# EAGLE design cerberus-h2 (EAGLE 5.10)
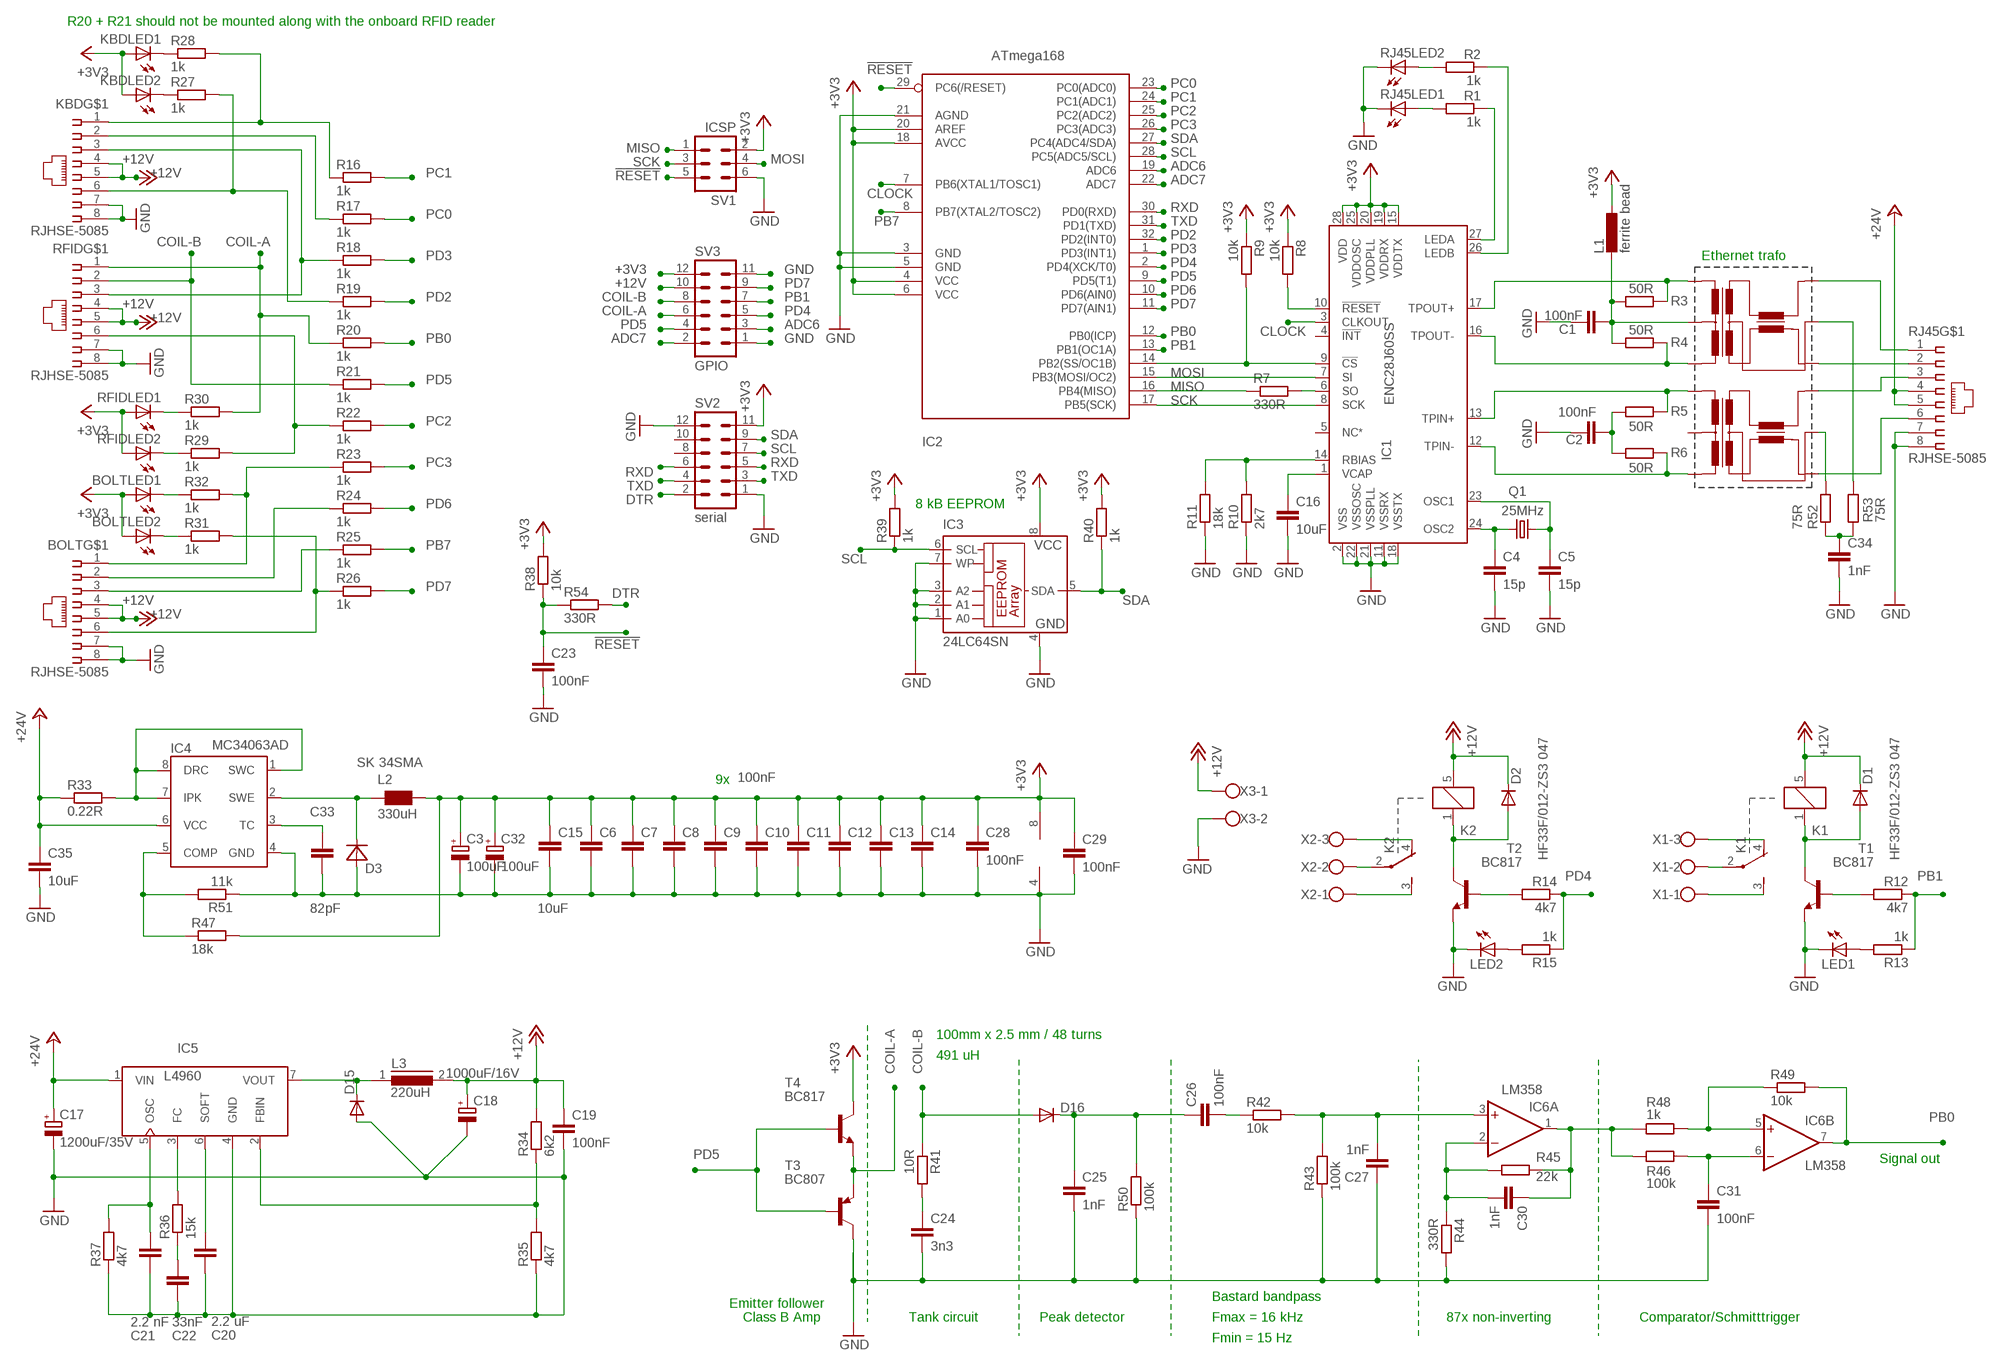
[diagram p0: schematic, sheet 1]

## Parts
BOLT  RJHSE-5085  [RJ45]
C1  100nF  C-EUC0805  [C0805]
C2  100nF  C-EUC0805  [C0805]
C3  100uF  CPOL-EUSANYO_SMD_C6  [SANYO-OSCON_SMD_C6]
C4  15p  C-EUC0805  [C0805]
C5  15p  C-EUC0805  [C0805]
C6  100nF  C-EUC0805  [C0805]
C7  100nF  C-EUC0805  [C0805]
C8  100nF  C-EUC0805  [C0805]
C9  100nF  C-EUC0805  [C0805]
C10  100nF  C-EUC0805  [C0805]
C11  100nF  C-EUC0805  [C0805]
C12  100nF  C-EUC0805  [C0805]
C13  100nF  C-EUC0805  [C0805]
C14  100nF  C-EUC0805  [C0805]
C15  10uF  C-EUC0805  [C0805]
C16  10uF  C-EUC0805  [C0805]
C17  1200uF/35V  CPOL-EUE5-13  [E5-13]
C18  1000uF/16V  CPOL-EUE5-13  [E5-13]
C19  100nF  C-EUC0805  [C0805]
C20  2.2 uF  C-EUC0805  [C0805]
C21  2.2 nF  C-EUC0805  [C0805]
C22  33nF  C-EUC0805  [C0805]
C23  100nF  C-EUC0805  [C0805]
C24  3n3  C-EUC0805  [C0805]
C25  1nF  C-EUC0805  [C0805]
C26  100nF  C-EUC0805  [C0805]
C27  1nF  C-EUC0805  [C0805]
C28  100nF  C-EUC0805  [C0805]
C29  100nF  C-EUC0805  [C0805]
C30  1nF  C-EUC0805  [C0805]
C31  100nF  C-EUC0805  [C0805]
C32  100uF  CPOL-EUSANYO_SMD_C6  [SANYO-OSCON_SMD_C6]
C33  82pF  C-EUC0805  [C0805]
C34  1nF  C-EUC0805  [C0805]
C35  10uF  C-EUC0805  [C0805]
D1  DIODE-MINIMELF  [MINIMELF]
D2  DIODE-MINIMELF  [MINIMELF]
D3  SK 34SMA  MBRA340T3  [SMA]
D15  DIODE-TO220V  [TO220ACS]
D16  DIODE-MINIMELF  [MINIMELF]
IC1  ENC28J60SS  [SSOP28]
IC2  ATmega168  MEGA8-AI  [TQFP32-08]
IC3  24LC64SN  [SO-08]
IC4  MC34063AD  [SO08]
IC5  L4960  [HEPTAWATT]
IC6  LM358  LM358D  [SO08]
K1  HF33F/012-ZS3 047  G5SB  [G5SB]
K2  HF33F/012-ZS3 047  G5SB  [G5SB]
KBD  RJHSE-5085  [RJ45]
L1  ferrite bead  L-EU0204V  [0204V@1]
L2  330uH  WE-TI_L  [WE-TI_L]
L3  220uH  A26GFC  [A26GFC]
LED1  LEDCHIP-LED0805  [CHIP-LED0805]
LED2  LEDCHIP-LED0805  [CHIP-LED0805]
Q1  25MHz  CRYSTALHC49UP  [HC49UP]
R1  1k  R-EU_R0805  [R0805]
R2  1k  R-EU_R0805  [R0805]
R3  50R  R-EU_R0805  [R0805]
R4  50R  R-EU_R0805  [R0805]
R5  50R  R-EU_R0805  [R0805]
R6  50R  R-EU_R0805  [R0805]
R7  330R  R-EU_R0805  [R0805]
R8  10k  R-EU_R0805  [R0805]
R9  10k  R-EU_R0805  [R0805]
R10  2k7  R-EU_R0805  [R0805]
R11  18k  R-EU_R0805  [R0805]
R12  4k7  R-EU_R0805  [R0805]
R13  1k  R-EU_R0805  [R0805]
R14  4k7  R-EU_R0805  [R0805]
R15  1k  R-EU_R0805  [R0805]
R16  1k  R-EU_R0805  [R0805]
R17  1k  R-EU_R0805  [R0805]
R18  1k  R-EU_R0805  [R0805]
R19  1k  R-EU_R0805  [R0805]
R20  1k  R-EU_R0805  [R0805]
R21  1k  R-EU_R0805  [R0805]
R22  1k  R-EU_R0805  [R0805]
R23  1k  R-EU_R0805  [R0805]
R24  1k  R-EU_R0805  [R0805]
R25  1k  R-EU_R0805  [R0805]
R26  1k  R-EU_R0805  [R0805]
R27  1k  R-EU_R0805  [R0805]
R28  1k  R-EU_R0805  [R0805]
R29  1k  R-EU_R0805  [R0805]
R30  1k  R-EU_R0805  [R0805]
R31  1k  R-EU_R0805  [R0805]
R32  1k  R-EU_R0805  [R0805]
R33  0.22R  R-EU_0204/2V  [0204V]
R34  6k2  R-EU_R0805  [R0805]
R35  4k7  R-EU_R0805  [R0805]
R36  15k  R-EU_R0805  [R0805]
R37  4k7  R-EU_R0805  [R0805]
R38  10k  R-EU_R0805  [R0805]
R39  1k  R-EU_R0805  [R0805]
R40  1k  R-EU_R0805  [R0805]
R41  10R  R-EU_R0805  [R0805]
R42  10k  R-EU_R0805  [R0805]
R43  100k  R-EU_R0805  [R0805]
R44  330R  R-EU_R0805  [R0805]
R45  22k  R-EU_R0805  [R0805]
R46  100k  R-EU_R0805  [R0805]
R47  18k  R-EU_R0805  [R0805]
R48  1k  R-EU_R0805  [R0805]
R49  10k  R-EU_R0805  [R0805]
R50  100k  R-EU_R0805  [R0805]
R51  11k  R-EU_R0805  [R0805]
R52  75R  R-EU_R0805  [R0805]
R53  75R  R-EU_R0805  [R0805]
R54  330R  R-EU_R0805  [R0805]
RFID  RJHSE-5085  [RJ45]
RJ45  RJHSE-5085  [RJ45]
SV1  ICSP  MA03-2  [MA03-2]
SV2  serial  MA06-2  [MA06-2]
SV3  GPIO  MA06-2  [MA06-2]
T1  BC817  BC817-16-NPN-SOT23-BEC  [SOT23-BEC]
T2  BC817  BC817-16-NPN-SOT23-BEC  [SOT23-BEC]
T3  BC807  BC807-16-PNP-SOT23-BEC  [SOT23-BEC]
T4  BC817  BC817-16-NPN-SOT23-BEC  [SOT23-BEC]
U$1  PE-68517L  [PE-68517]
X1  W237-103  [W237-103]
X2  W237-103  [W237-103]
X3  W237-102  [W237-102]

## Nets
12VPULSE: D15.C IC5.7(VOUT) L3.1
!RESET: C23.1 IC2.29(PC6(/RESET)) R38.1 R54.1 SV1.5
+3V3: BOLT.10(LED1:A) BOLT.12(LED2:A) C3.+ C6.1 C7.1 C8.1 C9.1 C10.1 C11.1 C12.1 C13.1 C14.1 C15.1 C28.1 C29.1 C32.+ IC1.15(VDDTX) IC1.19(VDDRX) IC1.20(VDDPLL) IC1.25(VDDOSC) IC1.28(VDD) IC2.4(VCC) IC2.6(VCC) IC2.18(AVCC) IC2.20(AREF) IC3.8(VCC) IC6.8(P:V+) KBD.10(LED1:A) KBD.12(LED2:A) L1.1 L2.1 R8.1 R9.1 R38.2 R39.2 R40.2 R47.2 RFID.10(LED1:A) RFID.12(LED2:A) SV1.2 SV2.11 SV3.12 T4.C
+12V: BOLT.4 BOLT.5 C18.+ C19.1 D1.C D2.C K1.5 K2.5 KBD.4 KBD.5 L3.2 R34.2 RFID.4 RFID.5 SV3.10 X3.1
+24V: C17.+ C35.1 IC4.6(VCC) IC5.1(VIN) R33.1 RJ45.4 RJ45.5
ADC6: IC2.19(ADC6) SV3.3
ADC7: IC2.22(ADC7) SV3.2
CLOCK: IC1.3(CLKOUT) IC2.7(PB6(XTAL1/TOSC1))
COIL-A: R20.1 R30.2 RFID.1 SV3.6 T3.E T4.E
COIL-B: D16.A R21.1 R41.1 RFID.2 SV3.8
DTR: R54.2 SV2.2
FC: IC5.3(FC) R36.2
GND: BOLT.7 BOLT.8 C1.1 C2.1 C3.- C4.2 C5.2 C6.2 C7.2 C8.2 C9.2 C10.2 C11.2 C12.2 C13.2 C14.2 C15.2 C16.2 C17.- C18.- C19.2 C20.2 C21.2 C22.2 C23.2 C24.2 C25.2 C27.1 C28.2 C29.2 C31.2 C32.- C33.2 C34.2 C35.2 D3.A D15.A IC1.2(VSS) IC1.11(VSSRX) IC1.18(VSSTX) IC1.21(VSSPLL) IC1.22(VSSOSC) IC2.3(GND) IC2.5(GND) IC2.21(AGND) IC3.1(A0) IC3.2(A1) IC3.3(A2) IC3.4(GND) IC3.7(WP) IC4.4(GND) IC5.4(GND) IC6.4(P:V-) KBD.7 KBD.8 LED1.C LED2.C R10.1 R11.1 R35.1 R37.1 R43.1 R44.2 R50.1 R51.1 RFID.7 RFID.8 RJ45.7 RJ45.8 RJ45.9(LED1:C) RJ45.11(LED2:C) SV1.6 SV2.1 SV2.12 SV3.1 SV3.11 T1.E T2.E T3.C X3.2
MISO: IC2.16(PB4(MISO)) R7.1 SV1.1
MOSI: IC1.7(SI) IC2.15(PB3(MOSI/OC2)) SV1.4
N$1: RJ45.1 U$1.9(RX+)
N$2: RJ45.2 U$1.10(RX-)
N$3: RJ45.3 U$1.8(TX+)
N$4: RJ45.6 U$1.7(TX-)
N$5: R2.2 RJ45.12(LED2:A)
N$6: R1.2 RJ45.10(LED1:A)
N$7: IC1.27(LEDA) R1.1
N$8: IC1.26(LEDB) R2.1
N$9: C1.2 L1.2 R3.2 R4.2 U$1.14(RCT)
N$12: IC1.10(!RESET) R8.2
N$13: C2.2 R5.2 R6.2
N$16: IC1.14(RBIAS) R10.2 R11.2
N$17: C16.1 IC1.1(VCAP)
N$18: C4.1 IC1.24(OSC2) Q1.1
N$19: IC1.6(SO) R7.2
N$20: C5.1 IC1.23(OSC1) Q1.2
N$21: K2.4(U:O) X2.3
N$23: D1.A K1.1 T1.C
N$24: K1.2(U:P) X1.2
N$25: R12.2 T1.B
N$26: K1.3(U:S) X1.1
N$27: LED1.A R13.2
N$28: D2.A K2.1 T2.C
N$29: R14.2 T2.B
N$30: K1.4(U:O) X1.3
N$31: K2.2(U:P) X2.2
N$32: K2.3(U:S) X2.1
N$33: LED2.A R15.2
N$34: KBD.3 R18.1 RFID.3
N$35: KBD.2 R17.1
N$37: IC5.2(FBIN) R34.1 R35.2
N$38: C21.1 IC5.5(OSC) R37.2
N$39: C22.1 R36.1
N$40: C20.1 IC5.6(SOFT)
N$41: KBD.6 R19.1 R27.2
N$42: KBD.1 R16.1 R28.2
N$45: R52.2 U$1.6(TXCT)
N$46: IC4.1(SWC) IC4.7(IPK) IC4.8(DRC) R33.2
N$47: R53.2 U$1.11(RXCT)
N$48: BOLT.3 R25.1
N$49: BOLT.1 R23.1 R32.2
N$51: KBD.9(LED1:C) R28.1
N$52: KBD.11(LED2:C) R27.1
N$55: BOLT.2 R24.1
N$56: R22.1 R29.2 RFID.6
N$57: R30.1 RFID.9(LED1:C)
N$58: R29.1 RFID.11(LED2:C)
N$59: BOLT.6 R26.1 R31.2
N$60: BOLT.9(LED1:C) R32.1
N$61: BOLT.11(LED2:C) R31.1
N$62: C24.1 R41.2
N$63: C25.1 C26.1 D16.C R50.2
N$64: C26.2 R42.1
N$65: C27.2 IC6.3(A:+IN) R42.2 R43.2
N$67: C30.2 IC6.2(A:-IN) R44.1 R45.1
N$68: C33.1 IC4.3(TC)
N$69: C31.1 IC6.6(B:-IN) R46.2
N$70: C30.1 IC6.1(A:OUT) R45.2 R46.1 R48.1
N$72: C34.1 R52.1 R53.1
N$76: IC4.5(COMP) R47.1 R51.2
N$81: IC6.5(B:+IN) R48.2 R49.1
PB0: IC2.12(PB0(ICP)) IC6.7(B:OUT) R20.2 R49.2
PB1: IC2.13(PB1(OC1A)) R12.1 R13.1 SV3.7
PB2: IC1.9(!CS) IC2.14(PB2(SS/OC1B)) R9.2
PB7: IC2.8(PB7(XTAL2/TOSC2)) R25.2
PC0: IC2.23(PC0(ADC0)) R17.2
PC1: IC2.24(PC1(ADC1)) R16.2
PC2: IC2.25(PC2(ADC2)) R22.2
PC3: IC2.26(PC3(ADC3)) R23.2
PD2: IC2.32(PD2(INT0)) R19.2
PD3: IC2.1(PD3(INT1)) R18.2
PD4: IC2.2(PD4(XCK/T0)) R14.1 R15.1 SV3.5
PD5: IC2.9(PD5(T1)) R21.2 SV3.4 T3.B T4.B
PD6: IC2.10(PD6(AIN0)) R24.2
PD7: IC2.11(PD7(AIN1)) R26.2 SV3.9
RXD: IC2.30(PD0(RXD)) SV2.5 SV2.6
SCK: IC1.8(SCK) IC2.17(PB5(SCK)) SV1.3
SCL: IC2.28(PC5(ADC5/SCL)) IC3.6(SCL) R39.1 SV2.7
SDA: IC2.27(PC4(ADC4/SDA)) IC3.5(SDA) R40.1 SV2.9
SWE: D3.C IC4.2(SWE) L2.2
TPIN+: IC1.13(TPIN+) R5.1 U$1.1(TD+)
TPIN-: IC1.12(TPIN-) R6.1 U$1.2(TD-)
TPOUT+: IC1.17(TPOUT+) R3.1 U$1.16(RD+)
TPOUT-: IC1.16(TPOUT-) R4.1 U$1.15(RD-)
TXD: IC2.31(PD1(TXD)) SV2.3 SV2.4
Unconnected: IC1.4(!INT) IC1.5(NC*) SV2.8 SV2.10 U$1.3(TCT)

## Notes on the sheet
- R20 + R21 should not be mounted along with the onboard RFID reader
- Ethernet trafo
- 8 kB EEPROM
- 9x
- 100mm x 2.5 mm / 48 turns
- 491 uH
- Signal out
- Bastard bandpass
- Emitter follower
- Class B Amp | Tank circuit | Peak detector | Fmax = 16 kHz | 87x non-inverting | Comparator/Schmitttrigger
- Fmin = 15 Hz

## Library data of the parts
BOLT KBD RFID RJ45 = amp-rj45-tap-up-with-leds:RJHSE-5085: Amphenol RJHSE-5085 - RJ45 with 2 leds and tap-up.
C1 C2 C4-C16 C19-C31 C34 C35 = rcl:C-EU: CAPACITOR, European symbol
C3 C17 C18 C32 = rcl:CPOL-EU: POLARIZED CAPACITOR, European symbol
C33 = resistor:C-EU: CAPACITOR, European symbol
D1 D2 D15 D16 = diode:DIODE-: DIODE
D3 = diode:MBRA340T3: Surface Mount Schottky Power Rectifier Source: http://www.onsemi.com/pub_link/Collateral/MBRA340T3-D.PDF
IC1 = microchip-6:ENC28J60: Stand-Alone Ethernet Controller with SPI Interface Source: http://ww1.microchip.com/downloads/en/DeviceDoc/39662c.pdf
IC2 = atmel:MEGA8: MICROCONTROLLER 8 Kbytes FLASH, 1 kbytes SRAM, 512 bytes EEPROM, USART, 6-channel 10 bit ADC, 2-channel 8 bit ADC Pin compatible with Atmega48, ATMega88, ATMega168 Source: avr.lbr
IC3 = microchip:24*: Serial EEPROM I2C
IC4 = v-reg-3:MC34063A: 1.5A Step-Up/Down/Inverting Switching Regulator NPN Darlington Switch, Vin 3V to 40V, Current Limiter Input, adjustable Frequency up to 100kHz
IC5 = l4960:L4960: 2.5A POWER SWITCHING REGULATOR
IC6 = linear:LM358: OP AMP also LM158; LM258; LM2904 Source: http://cache.national.com/ds/LM/LM158.pdf
K1 K2 = relay:G5SB: Compact Single-pole Relay for Switching 5 A Source: http://www.omron.com/ecb/products/pry/121/g5sb.html
L1 = rcl:L-EU: INDUCTOR, European symbol
L2 = wuerth-elektronik:WE-TI: Radial Leaded Wire Wound Inductor WE-TI A low-cost storage/filtering possibility in comparison to SMD versions - Radial through-hole inductor - High saturation core material -- Signal filtering -- NF-switches
L3 = inductors:A26GFC: INDUCTOR
LED1 LED2 = led:LED: LED OSRAM: - CHIPLED LG R971, LG N971, LY N971, LG Q971, LY Q971, LO R971, LY R971 LH N974, LH R974 LS Q976, LO Q976, LY Q976 LO Q996 - Hyper CHIPLED LW Q18S LB Q993, LB Q99A, LB R99A - SideLED LS A670, LO A670, LY A670, LG A670, LP A670 LB A673, LV A673, LT A673, LW A673 LH A674 LY A675 LS A676, LA A676, LO A676, LY A676, LW A676 LS A679, LY A679, LG A679 - Hyper Micro SIDELED® LS Y876, LA Y876, LO Y876, LY Y876 LT Y87S - SmartLED LW L88C, LW L88S LB L89C, LB L89S, LG L890 LS L89K, LO L89K, LY L89K LS L896, LA L896, LO L896, LY L896 - TOPLED LS T670, LO T670, LY T670, LG T670, LP T670 LSG T670, LSP T670, LSY T670, LOP T670, LYG T670 LG T671, LOG T671, LSG T671 LB T673, LV T673, LT T673, LW T673 LH T674 LS T676, LA T676, LO T676, LY T676, LB T676, LH T676, LSB T676, LW T676 LB T67C, LV T67C, LT T67C, LS T67K, LO T67K, LY T67K, LW E67C LS E67B, LA E67B, LO E67B, LY E67B, LB E67C, LV E67C, LT E67C LW T67C LS T679, LY T679, LG T679 LS T770, LO T770, LY T770, LG T770, LP T770 LB T773, LV T773, LT T773, LW T773 LH T774 LS E675, LA E675, LY E675, LS T675 LS T776, LA T776, LO T776, LY T776, LB T776 LHGB T686 LT T68C, LB T68C - Hyper Mini TOPLED® LB M676 - Mini TOPLED Santana® LG M470 LS M47K, LO M47K, LY M47K Source: http://www.osram.convergy.de LUXEON: - LUMILED® LXK2-PW12-R00, LXK2-PW12-S00, LXK2-PW14-U00, LXK2-PW14-V00 LXK2-PM12-R00, LXK2-PM12-S00, LXK2-PM14-U00 LXK2-PE12-Q00, LXK2-PE12-R00, LXK2-PE12-S00, LXK2-PE14-T00, LXK2-PE14-U00 LXK2-PB12-K00, LXK2-PB12-L00, LXK2-PB12-M00, LXK2-PB14-N00, LXK2-PB14-P00, LXK2-PB14-Q00 LXK2-PR12-L00, LXK2-PR12-M00, LXK2-PR14-Q00, LXK2-PR14-R00 LXK2-PD12-Q00, LXK2-PD12-R00, LXK2-PD12-S00 LXK2-PH12-R00, LXK2-PH12-S00 LXK2-PL12-P00, LXK2-PL12-Q00, LXK2-PL12-R00 Source: www.luxeon.com KINGBRIGHT: KA-3528ASYC Source: www.kingbright.com
Q1 = crystal:CRYSTAL: CRYSTAL
R1-R54 = rcl:R-EU_: RESISTOR, European symbol
SV1 = con-lstb:MA03-2: PIN HEADER
SV2 SV3 = con-lstb:MA06-2: PIN HEADER
T1 T2 T4 = transistor:*-NPN-: NPN Transistror BF959 corrected 2008.03.06
T3 = transistor:*-PNP-: PNP Transistror
U$1 = pulse-pe-68517-ethernet-trafo:PE-68517L
X1 X2 = con-wago-500:W237-103: WAGO SCREW CLAMP
X3 = con-wago-500:W237-102: WAGO SCREW CLAMP

## Board
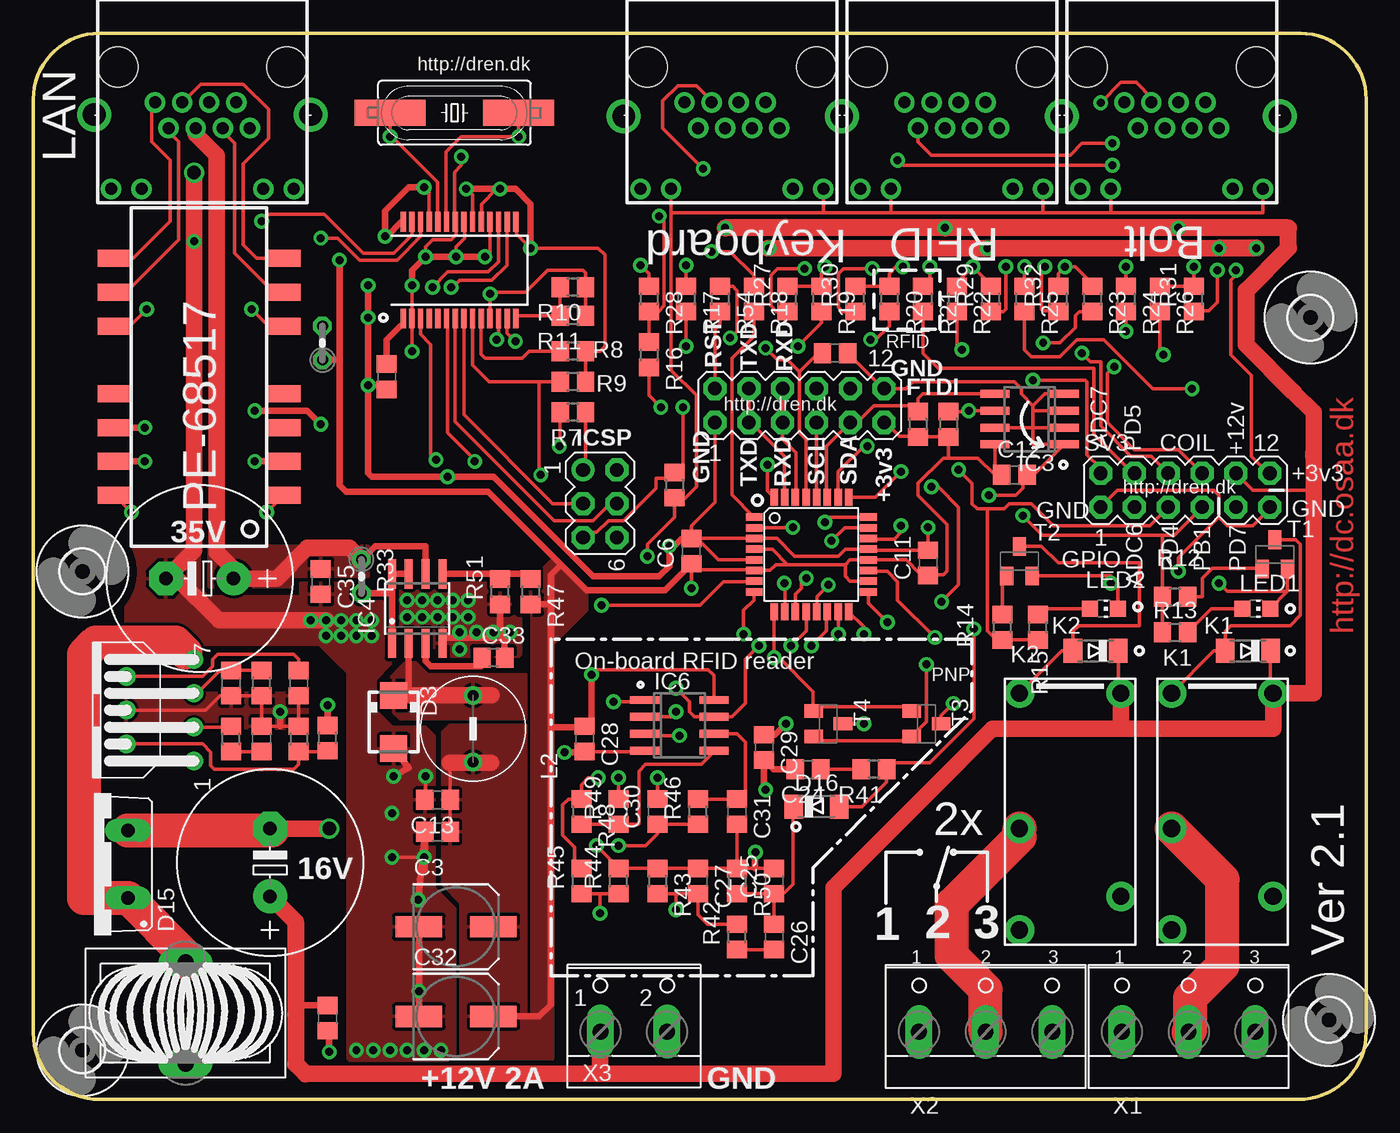
[diagram p1: board, top side]
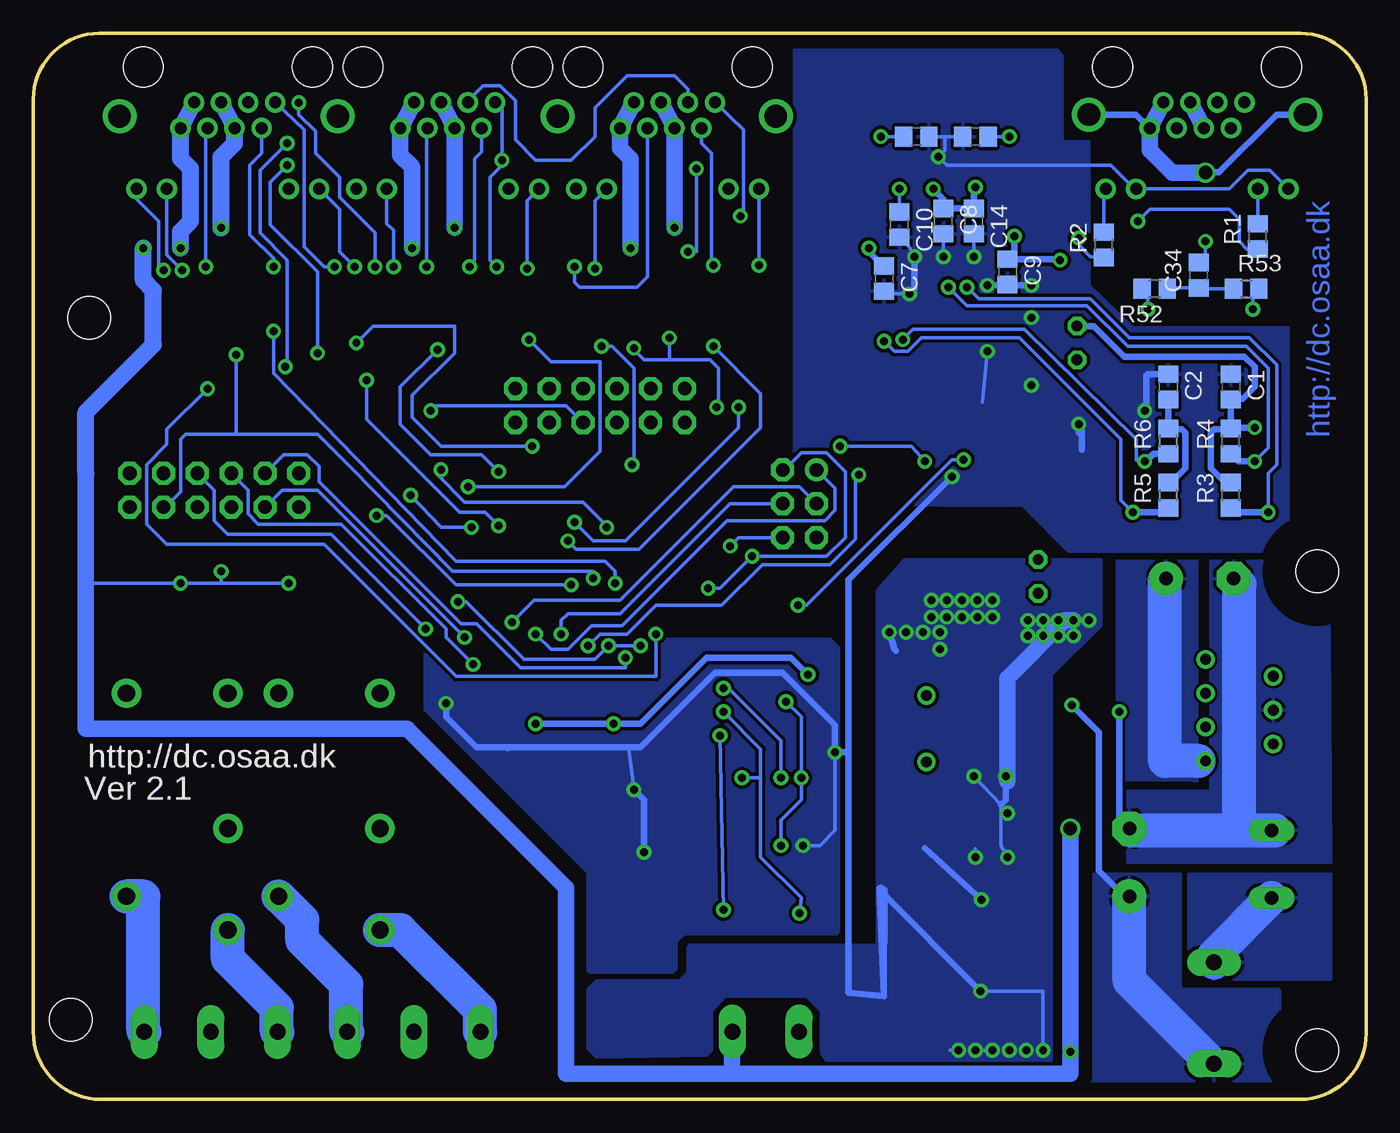
[diagram p2: board, bottom side, seen from below]

Size 100.08 x 80.01 mm. Coordinates in mm from the lower left corner, seen from the top.
Outline: 95.05,80 4.95,80
Outline: 5.08,80.01 4.95,80.01 arc90 0,75.06 0,4.95 arc90 4.95,0 95,0 arc90 100.08,5.08 100.08,75.06 arc90 95.12,80.01 95,80.01
Copper layers (1*16): Top 0.035mm / dielectric 1.5mm / Bottom 0.035mm
Design rules "8mils *": minimum track width 8mil, minimum drill 0.6mm, track to track 8mil, track to pad 8mil, pad to pad 8mil, via to via 8mil, smd to smd 8mil, copper to edge 40mil, drill to drill 10mil, minimum pad ring 8mil, minimum via ring 10mil, stop-mask expansion 0mil, vias tented up to drill 0mil, thermal gap 10mil

### Footprints (pad centres in the part's own frame; a part is rotated, then mirrored left to right if it is on the bottom)
RJ45 = drill 0.9 pad 1.27 round: 1 9.906,2.64; 2 8.89,4.58; 3 7.874,2.64; 4 6.858,4.58; 5 5.842,2.64; 6 4.826,4.58; 7 3.81,2.64; 8 2.794,4.58; 9 13.208,9.144; 10 10.922,9.144; 11 1.778,9.144; 12 -0.508,9.144 | hole 3: 0,0; 12.7,0
C0805 = smd 1.3 x 1.5: 1 -0.95,0; 2 0.95,0
SANYO-OSCON_SMD_C6 = smd 3.5 x 1.6: + 2.8,0; - -2.8,0
E5-13 = drill 1.016 pad 2.54 round: + -2.54,0 | drill 1.016 pad 2.54 octagon: - 2.54,0
C0805' = smd 1.3 x 1.5: 1 -0.85,0; 2 0.85,0
MINIMELF = smd 1.4 x 1.8: A 1.7,0; C -1.7,0
SMA = smd 2 x 2: A 2,0; C -2,0
TO220ACS = drill 1.016 long: A 2.54,-2.54; C -2.54,-2.54
SSOP28 = smd 0.4 x 1.5: 1 -4.225,-3.625; 2 -3.575,-3.625; 3 -2.925,-3.625; 4 -2.275,-3.625; 5 -1.625,-3.625; 6 -0.975,-3.625; 7 -0.325,-3.625; 8 0.325,-3.625; 9 0.975,-3.625; 10 1.625,-3.625; 11 2.275,-3.625; 12 2.925,-3.625; 13 3.575,-3.625; 14 4.225,-3.625; 15 4.225,3.625; 16 3.575,3.625; 17 2.925,3.625; 18 2.275,3.625; 19 1.625,3.625; 20 0.975,3.625; 21 0.325,3.625; 22 -0.325,3.625; 23 -0.975,3.625; 24 -1.625,3.625; 25 -2.275,3.625; 26 -2.925,3.625; 27 -3.575,3.625; 28 -4.225,3.625
TQFP32-08 = smd 1.27 x 0.559: 1 -4.293,2.8; 2 -4.293,2; 3 -4.293,1.2; 4 -4.293,0.4; 5 -4.293,-0.4; 6 -4.293,-1.2; 7 -4.293,-2; 8 -4.293,-2.8; 17 4.293,-2.8; 18 4.293,-2; 19 4.293,-1.2; 20 4.293,-0.4; 21 4.293,0.4; 22 4.293,1.2; 23 4.293,2; 24 4.293,2.8 | smd 0.559 x 1.27: 9 -2.8,-4.293; 10 -2,-4.293; 11 -1.2,-4.293; 12 -0.4,-4.293; 13 0.4,-4.293; 14 1.2,-4.293; 15 2,-4.293; 16 2.8,-4.293; 25 2.8,4.293; 26 2,4.293; 27 1.2,4.293; 28 0.4,4.293; 29 -0.4,4.293; 30 -1.2,4.293; 31 -2,4.293; 32 -2.8,4.293
SO-08 = smd 0.6 x 2.2: 1 -1.905,-2.6; 2 -0.635,-2.6; 3 0.635,-2.6; 4 1.905,-2.6; 5 1.905,2.6; 6 0.635,2.6; 7 -0.635,2.6; 8 -1.905,2.6
SO08 = smd 0.6 x 2.2: 1 -1.905,-2.6; 2 -0.635,-2.6; 3 0.635,-2.6; 4 1.905,-2.6; 5 1.905,2.6; 6 0.635,2.6; 7 -0.635,2.6; 8 -1.905,2.6
HEPTAWATT = drill 0.813 round: 1 3.81,5.08; 2 2.54,0; 3 1.27,5.08; 4 0,0; 5 -1.27,5.08; 6 -2.54,0; 7 -3.81,5.08
G5SB = drill 1.3 pad 1.93 round: 1 7.62,3.81; 5 7.62,-3.81 | drill 1.3 pad 2.184 round: 2 -2.54,3.81; 3 -10.16,3.81; 4 -7.62,-3.81
0204V@1 = drill 0.813 octagon: 1 -1.27,0; 2 1.27,0
WE-TI_L = drill 0.813 round: 1 -2.5,0; 2 2.5,0
A26GFC = drill 1.194 long: 1 0,3.81; 2 0,-3.81
CHIP-LED0805 = smd 1.2 x 1.2: A 0,-1.05; C 0,1.05
HC49UP = smd 5.334 x 1.93: 1 -4.826,0; 2 4.826,0
R0805 = smd 1.3 x 1.5: 1 -0.95,0; 2 0.95,0
0204V = drill 0.813 octagon: 1 -1.27,0; 2 1.27,0
MA03-2 = drill 1.016 round: 1 -2.54,-1.27 | drill 1.016 octagon: 2 -2.54,1.27; 3 0,-1.27; 4 0,1.27; 5 2.54,-1.27; 6 2.54,1.27
MA06-2 = drill 1.016 octagon: 1 -6.35,-1.27; 2 -6.35,1.27; 3 -3.81,-1.27; 4 -3.81,1.27; 5 -1.27,-1.27; 6 -1.27,1.27; 7 1.27,-1.27; 8 1.27,1.27; 9 3.81,-1.27; 10 3.81,1.27; 11 6.35,-1.27; 12 6.35,1.27
SOT23-BEC = smd 1 x 1.4: B -0.95,-1.1; C 0,1.1; E 0.95,-1.1
PE-68517 = smd 2.54 x 1.27: 1 -7.62,7.62; 2 -7.62,5.08; 3 -7.62,2.54; 4 -7.62,0; 6 -7.62,-5.08; 7 -7.62,-7.62; 8 -7.62,-10.16; 9 5.08,-10.16; 10 5.08,-7.62; 11 5.08,-5.08; 13 5.08,0; 14 5.08,2.54; 15 5.08,5.08; 16 5.08,7.62
3,2 = hole 3.2: 0,0
W237-103 = drill 1.194 long: 1 -5,-1.29; 2 0,-1.29; 3 5,-1.29
W237-102 = drill 1.194 long: 1 -2.5,-1.27; 2 2.5,-1.27

### Placement (x,y rotation side)
BOLT  91.82,77.47 180 top
C1  10.16,53.47 270 bottom
C2  14.86,53.47 270 bottom
C3  31.75,12.95 0 top
C4  29.34,72.26 180 bottom
C5  33.78,72.26 0 bottom
C6  49.4,41.15 90 top
C7  36.2,61.59 270 bottom
C8  31.75,65.91 270 bottom
C9  26.92,62.1 270 bottom
C10  35.05,65.66 270 bottom
C11  67.18,40.26 90 top
C12  73.66,46.86 0 top
C13  30.35,22.48 180 top
C14  29.46,65.91 270 bottom
C15  30.35,20.07 180 top
C16  26.54,54.23 270 top
C17  12.5,39.09 180 top
C18  17.78,17.78 90 top
C19  22.1,6.1 270 top
C20  19.94,31.24 270 top
C21  14.86,31.24 270 top
C22  17.14,27.05 90 top
C23  60.2,56.01 0 top
C24  58.17,24.77 180 top
C25  55.63,16.38 90 top
C26  55.63,12.19 270 top
C27  49.91,16.38 270 top
C28  41.4,27.05 270 top
C29  54.86,26.42 270 top
C30  46.86,21.59 90 top
C31  52.83,21.59 270 top
C32  31.75,6.22 0 top
C33  82pF  [C0805']  34.54,33.15 0 top
C34  12.57,61.85 90 bottom
C35  21.59,38.86 270 top
D1  91.19,33.66 180 top
D2  79.76,33.66 180 top
D3  27.05,28.32 270 top
D15  4.57,17.65 90 top
D16  58.8,21.97 0 top
IC1  32,62.23 0 top
IC2  58.42,40.89 0 top
IC3  74.8,51.05 90 top
IC4  28.83,36.83 0 top
IC5  6.99,29.21 270 top
IC6  48.51,28.07 270 top
K1  89.28,22.86 90 top
K2  77.85,22.86 90 top
KBD  58.8,77.47 180 top
L1  21.72,56.77 90 top
L2  33.02,27.81 90 top
L3  11.43,6.48 0 top
LED1  91.82,36.83 270 top
LED2  80.39,36.83 270 top
Q1  31.62,74.04 0 top
R1  8.13,64.77 90 bottom
R2  19.68,64.14 90 bottom
R3  10.16,45.34 90 bottom
R4  10.16,49.4 90 bottom
R5  14.86,45.34 90 bottom
R6  14.86,49.4 90 bottom
R7  40.51,51.56 180 top
R8  40.51,56.13 180 top
R9  40.51,53.85 180 top
R10  40.51,60.96 180 top
R11  40.51,58.8 180 top
R12  85.72,37.72 0 top
R13  85.72,35.05 0 top
R14  72.77,35.43 90 top
R15  75.44,35.43 90 top
R16  46.23,55.88 270 top
R17  49.02,60.07 270 top
R18  54.1,60.07 270 top
R19  59.18,60.07 270 top
R20  64.26,60.07 270 top
R21  66.8,60.07 270 top
R22  69.34,60.07 270 top
R23  79.5,60.07 270 top
R24  82.04,60.07 270 top
R25  74.42,60.07 270 top
R26  84.58,60.07 270 top
R27  56.64,60.07 90 top
R28  46.23,60.07 270 top
R29  71.88,60.07 90 top
R30  61.72,60.07 90 top
R31  87.12,60.07 90 top
R32  76.96,60.07 90 top
R33  24.64,39.24 270 top
R34  22.1,27.11 90 top
R35  19.94,27.05 270 top
R36  14.86,27.05 90 top
R37  17.14,31.24 90 top
R38  48.13,46.1 270 top
R39  68.71,50.67 270 top
R40  66.42,50.67 270 top
R41  63.12,24.77 180 top
R42  52.83,12.19 90 top
R43  46.86,16.38 270 top
R44  43.94,16.38 90 top
R45  41.15,16.38 90 top
R46  49.91,21.59 90 top
R47  37.34,38.1 270 top
R48  41.15,21.59 270 top
R49  43.94,21.59 90 top
R50  52.83,16.38 270 top
R51  35.05,38.1 90 top
R52  15.88,60.83 180 bottom
R53  9.02,60.83 0 bottom
R54  51.56,60.07 270 top
RFID  75.31,77.47 180 top
RJ45  19.05,77.47 180 top
SV1  42.55,44.7 270 top
SV2  57.53,52.07 0 top
SV3  86.49,45.72 0 top
T1  93.22,40.89 0 top
T2  74.04,40.39 0 top
T3  67.06,28.19 270 top
T4  59.69,28.19 270 top
U$1  11.18,52.96 180 top
U$3  [3,2]  3.68,3.68 0 top
U$4  [3,2]  95.89,58.67 0 top
U$5  [3,2]  97.28,5.97 0 top
U$6  [3,2]  3.68,39.62 0 top
X1  86.74,6.35 0 top
X2  71.5,6.35 0 top
X3  45.09,6.35 0 top

### Tracks (layer width: path | path; a pad name or v marks a point on that pad's centre or on a via)
12VPULSE
  Top 1.27: 11.43,33.53 IC5.7
  Top 2.54: 3.81,15.24 3.81,15.11 | 3.81,15.24 3.81,33.4 4.7,34.29 10.67,34.29 11.43,33.53 | 3.81,15.24 3.94,15.11 D15.C 11.43,10.79 L3.1
  Bottom 2.54: L3.1 11.43,10.79 D15.C
  pour Bottom: 13.34,16.89 13.34,9.02 2.67,9.02 2.67,16.89
!RESET  (via drill 0.6)
  Top 0.254: IC2.29 58.02,49.55 57.53,50.04 57.53,54.61 | v54.99,56.39 55.88,55.5 56.64,55.5 57.53,54.61 | v48.77,51.94 48.77,47.69 R38.1 48.13,46.86 47.88,46.61 46.74,46.61 46.74,45.85 44.32,43.43 43.18,43.43 42.29,42.55 41.66,42.55 SV1.5 | C23.1 58.93,56.01 57.53,54.61 | R54.1 52.52,61.02 52.83,60.71 52.83,57.66 v52.32,57.15
  Bottom 0.254: v48.77,51.94 48.64,52.07 48.64,54.86 49.28,55.5 52.32,55.5 | v54.99,56.39 54.99,56.26 54.23,55.5 52.32,55.5 | 52.32,55.5 v52.32,57.15
+3V3  (via drill 0.6)
  Top 0.254: 49.91,39.75 49.46,40.2 C6.1 v49.4,38.35 | 49.91,39.75 49.66,39.75 | 49.91,39.75 54.07,39.75 IC2.6 55.31,39.69 55.75,40.13 56.64,40.13 | IC2.4 54.15,41.27 55.5,41.27 56.64,40.13 | 60.96,40.13 61.32,40.49 IC2.20 65.55,40.49 66.55,39.5 66.55,39.02 66.67,38.89 67.4,38.89 C11.1 67.24,39.37 68.33,39.37 68.58,39.62 68.58,43.18 66.42,45.34 66.42,46.23 68.33,48.13 68.71,48.13 | 62.62,38.99 IC2.18 61.31,38.89 60.96,39.24 60.96,40.13 | 56.64,40.13 60.96,40.13 | 72.2,46.86 IC3.8 | 72.2,46.86 C12.1 | v46.1,40.77 46.1,41.66 48.13,43.69 R38.2 48.2,45.09 48.9,45.09 49.78,45.97 49.78,52.83 47.88,54.74 47.88,66.55 | 44.32,38.23 44.32,38.1 | 68.71,48.13 70.93,48.13 72.2,46.86 | SV3.12 92.71,46.99 91.44,48.26 91.44,54.36 89.92,55.88 89.92,61.47 90.3,61.85 v90.3,62.23 | IC6.8 51.11,31.82 50.67,32.26 42.29,32.26 v41.91,31.88 | v62.36,28.19 T4.C | C28.1 41.91,28.51 | BOLT.12 92.33,66.55 80.9,66.55 | 47.88,66.55 59.44,66.55 | 59.44,66.55 64.39,66.55 | 64.39,66.55 75.82,66.55 | 75.82,66.55 80.9,66.55 | 47.88,66.55 KBD.10 | KBD.12 59.31,66.67 59.44,66.55 | 64.39,66.55 RFID.10 | 75.82,66.55 RFID.12 | 80.9,66.55 BOLT.10 | SV2.11 64.01,50.8 65.02,49.78 66.36,49.78 R40.2 R39.2 68.71,48.13 | 36.32,65.95 IC1.15 36.3,65.79 36.3,64.92 v37.34,63.88 42.42,63.88 42.93,63.37 42.93,56.52 42.55,56.13 R8.1 R9.1 | v35.05,68.33 34.8,68.33 33.66,67.18 33.66,65.88 IC1.19 | IC1.20 32.98,67.9 v32.51,68.33 | IC1.25 29.72,65.87 29.72,68.07 v29.34,68.45 | C15.1 C13.1 31.3,23.94 31.24,25.27 | 27.56,65.79 27.71,65.79 IC1.28
  Top 0.5: 49.72,40.39 C6.1 47.43,38.23 44.32,38.23 41.53,38.23 39.62,40.13 | 39.62,40.13 34.16,45.59 23.5,45.59 22.99,46.1 22.99,55.37 | 38.86,27.94 38.86,7.11 37.97,6.22 C32.+ | 38.86,27.94 41.34,27.94 C28.1 | 38.86,27.94 38.86,37.08 | 38.86,37.08 38.86,39.37 39.62,40.13 | 34.55,5.85 34.42,5.71 34.42,6.09 | C3.+ 34.67,13.07 | 41.91,28.51 v41.91,31.88 | C29.1 55.69,27.37 v56.52,28.19 | v32.51,68.33 v35.05,68.33 36.2,68.33 37.34,67.18 v37.34,63.88 | 22.99,55.37 v22.99,62.99 | R47.2 38.8,37.15 38.86,37.08 | v29.34,68.45 28.19,68.45 26.42,66.67 v26.42,64.77 26.67,64.9 27.56,65.79 | L1.1 22.86,55.5 22.99,55.37
  Top 1.25: 31.24,25.27 34.38,25.27 L2.1
  Bottom 0.254: SV1.2 43.69,47.24 42.42,48.51 40.51,48.51 39.12,47.12 39.12,42.16 40.51,40.77 v46.1,40.77 48.51,38.35 v49.4,38.35 | BOLT.12 92.33,67.56 90.68,65.91 90.68,62.61 v90.3,62.23 | v35.05,68.33 C10.1 | v29.34,68.45 29.46,68.2
  Bottom 0.5: v62.36,28.19 v56.52,28.19 54.48,28.19 49.53,33.15 43.18,33.15 v41.91,31.88 | C7.1 37.34,63.63 v37.34,63.88 | 29.46,68.2 C14.1 C8.1 31.75,67.56 v32.51,68.33 | v22.99,62.99 23.05,63.05 C9.1 26.42,63.56 v26.42,64.77
  pour Top (isolate 0.254): 36.96,28.07 36.96,3.05 32.26,3.05 32.13,3.17 32.13,14.73 30.73,16.13 30.73,27.56 31.24,28.07
  pour Top: 37.08,3.05 38.99,3.05 38.99,34.16 41.53,36.7 41.53,38.23 39.12,40.64 36.83,38.35 36.83,37.47 37.08,37.21 37.21,37.21 37.47,36.96 37.47,6.22 36.96,6.22
+12V  (via drill 0.6)
  Top 0.254: D2.C 81.46,30.68 K2.5 82.3,29.84 | K1.5 92.89,30.68 D1.C | 96.14,48.26 96.27,46.99 | 96.14,48.51 95.89,48.26 | SV3.10 91.57,45.72 95.63,45.72 96.14,45.21
  Top 0.5: C19.1 19.75,7.05 19.68,6.35 | v22.1,29.59 R34.2
  Top 1.25: 81.66,27.81 72.01,27.81 60.07,15.88 60.07,1.91 42.55,1.91 | 81.66,27.81 K2.5 | 81.66,27.81 93.09,27.81 K1.5 96.14,30.48 96.14,45.21 96.14,48.26 | 18.03,15.88 18.03,15.49 C18.+ | 20.45,1.91 42.55,1.91 | 42.55,1.91 42.55,5.04 X3.1 | 94.61,53.09 96.14,51.56 96.14,48.51
  Top 1.27: C18.+ 19.68,13.34 19.68,6.35 19.68,2.67 20.45,1.91 | 96.14,48.26 96.14,48.51 | 94.61,53.09 91.06,56.64 91.06,60.71 94.23,63.88 94.23,65.41 v85.98,65.41 v68.45,65.41 v51.94,65.41
  Bottom 0.5: C18.+ 18.16,15.24 20.07,17.14 20.07,27.56 v22.1,29.59
  Bottom 1.25: L3.2 11.94,3.05 | KBD.5 KBD.4 v51.94,65.41 | RFID.5 RFID.4 v68.45,65.41 | BOLT.4 BOLT.5
  Bottom 1.27: v85.98,65.41 85.98,70.74 84.96,71.75 BOLT.4
  Bottom 2.54: 11.94,3.05 17.78,8.89 C18.+
  pour Bottom: 20.57,1.4 20.45,1.52 20.45,16.89 13.97,16.89 13.97,8.38 13.84,8.26 6.6,8.26 6.48,8.13 6.48,1.4
+24V
  Top 0.5: IC4.6 29.46,41.53 25.65,41.53 R33.1
  Top 1.25: RJ45.4 12.19,72.42 13.77,70.84 13.77,41.06 14.9,39.93 14.9,39.23 C17.+ 18.26,39.09 20.57,41.4 23.75,41.4 R33.1 24.51,40.39
  Bottom 1.25: RJ45.4 RJ45.5 | C17.+ 15.14,38.99
  Bottom 1.27: IC5.1 12.57,25.4
  Bottom 2.54: 12.57,25.4 15.11,25.4 15.11,39.01 C17.+
  pour Top: 13.21,41.53 13.21,38.48 19.43,38.48 19.43,39.24 25.15,39.24 25.15,41.53
  pour Bottom: 13.46,24 18.67,24 18.67,29.72 18.67,40.39 12.7,40.39 12.7,23.88
ADC6  (via drill 0.6)
  Top 0.254: 62.77,39.75 IC2.19 62.78,39.62 64.14,39.62 64.9,38.86 64.9,37.47 v67.69,34.67
  Bottom 0.254: SV3.3 81.41,45.72 78.74,45.72 v67.69,34.67
ADC7  (via drill 0.6)
  Top 0.254: 62.78,42.16 IC2.22 62.77,42.04 64.64,42.04 65.15,42.55 v65.15,43.05 | SV3.2 80.14,47.37 79.12,48.39 79.12,53.85 78.99,53.98 v75.06,53.98
  Bottom 0.254: v65.15,43.05 66.17,44.07 68.07,44.07 75.06,51.05 v75.06,53.98
CLOCK  (via drill 0.6)
  Top 0.254: IC2.7 54.09,38.86 51.82,38.86 50.04,37.08 v42.67,37.08 | IC1.3 29.08,57.41 29.84,56.64 29.84,48.39 v30.23,48.01
  Bottom 0.254: v42.67,37.08 42.04,37.08 31.11,48.01 v30.23,48.01
COIL-A  (via drill 0.6)
  Top 0.254: T4.E 58.61,27.24 59.31,26.92 65.25,26.92 T3.E 65.98,27.24 67.06,28.32 v67.06,32.64 | SV3.6 83.95,48.26 82.42,48.26 80.14,50.55 80.14,55.37 79.38,55.37 v78.74,56.01 | v81.03,70.1 65.28,70.1 v64.9,70.48 | R30.2 R20.1 64.26,61.98 64.77,62.48 v65.28,62.48
  Bottom 0.254: RFID.1 64.9,74.93 v64.9,70.48 64.9,70.1 65.79,69.22 65.79,62.99 v65.28,62.48 | SV3.6 83.95,45.72 83.95,43.94 83.19,43.18 76.96,43.18 69.09,35.31 69.09,34.67 v67.06,32.64 | v78.74,56.01 78.74,62.1 82.3,65.66 82.3,68.83 v81.03,70.1
COIL-B  (via drill 0.6)
  Top 0.254: RFID.2 66.42,71.88 67.44,70.87 77.85,70.87 78.74,71.75 v81.03,71.75 | v70.61,35.31 70.61,28.57 67.31,25.27 64.58,25.27 R41.1 64.07,23.81 62.23,21.97 D16.A | SV3.8 85.98,48.77 82.68,48.77 80.64,50.8 80.64,54.48 v81.15,54.99 | v67.31,62.48 67.31,61.53 R21.1
  Bottom 0.254: v70.61,35.31 77.72,42.42 85.47,42.42 86.49,43.43 86.49,45.72 SV3.8 | v81.03,71.75 83.06,69.72 83.06,65.02 81.03,62.99 81.03,55.12 v81.15,54.99 | v67.31,62.48 66.93,62.99 66.93,70.61 66.42,71.12 RFID.2
DTR
  Top 0.254: SV2.2 51.18,57.78 51.56,58.17 R54.2
FC
  Top 0.254: IC5.3 14.29,27.94 R36.2
GND  (via drill 0.6, 1, 1.7)
  Top 0.254: 92.77,36.93 LED1.C 94.17,38.13 | 81.44,38.73 LED2.C | v80.9,38.73 81.44,38.73 | SV2.1 51.18,44.83 49.4,43.05 C6.2 | C6.2 IC2.3 | IC2.3 52.89,42.09 | IC2.5 54.11,40.51 51.44,40.51 50.16,41.78 49.72,41.78 C6.2 | IC2.3 55.82,42.09 57.15,40.77 60.45,40.77 60.96,41.27 62.69,41.27 IC2.21 62.8,41.21 C11.2 v67.18,42.93 | 75.06,50.42 75.06,49.15 IC3.1 75.12,46.86 C12.2 74.3,46.8 74.3,45.85 73.79,45.34 v71.75,45.34 | 75.06,50.42 IC3.7 | 75.06,50.42 IC3.2 | 75.06,50.42 75.06,51.69 | 75.06,51.69 IC3.3 | 48.26,41.66 v47.75,41.53 | T3.C 68.16,28.79 v69.09,29.72 | T2.E 80.89,39.29 81.44,38.73 | 94.17,40.32 T1.E 94.17,38.13 | R50.1 52.89,17.33 | 52.89,17.33 54.19,17.33 C25.2 55.56,17.4 | C27.1 50.04,17.46 | R50.1 52.38,17.78 | R50.1 52.83,17.27 52.89,17.33 | C27.1 R50.1 | C27.1 R43.1 R44.2 43.94,17.4 v42.29,19.05 | IC6.4 45.85,26.1 C28.2 41.09,26.1 | 94.17,38.13 89.64,38.13 v89.03,38.73 | R50.1 C31.2 | 75.06,51.69 75.06,52.07 | 75.06,52.07 75.95,52.96 IC3.4 | SV3.1 81.41,45.72 88.65,45.72 89.03,45.34 89.03,43.69 | 89.03,43.69 85.98,40.64 85.98,39.75 | v85.98,39.62 85.98,39.75 | 85.98,39.75 85.85,39.37 | IC5.4 12.95,29.21 14.04,30.29 C21.2 R37.1 C22.2 18.54,28 R35.1 C20.2 | SV3.11 92.84,44.32 91.57,43.05 89.66,43.05 89.03,43.69 | C13.2 29.4,21.91 v29.46,24.26 | v26.92,18.16 v29.34,18.16 | IC1.11 v34.28,60.44 v34.29,60.45 34.42,60.58 36.96,60.58 38.61,62.23 41.27,62.23 41.46,62.04 R10.1 R11.1 | 32.38,65.91 IC1.21 32.38,65.8 32.38,64.64 31.75,64.01 v31.75,63.25 | IC1.18 34.28,63.26 v33.91,63.25 | 30.73,63.25 v29.46,63.25 29.46,64.01 29.97,64.52 31.37,64.52 31.75,64.9 31.75,65.78 IC1.22 31.62,65.91 31.62,69.6 32.13,70.1 v32.13,70.74
  Top 0.254: v28.45,56.13 28.45,58.59 IC1.2 28.43,61.07 v28.45,61.09 28.32,60.96 | 75.06,52.07 74.17,52.96 74.17,53.34 73.66,53.85 66.04,53.85 65.53,53.34 SV2.12 63.81,53.41 63.75,53.41 C23.2
  Top 0.5: C6.2 49.85,42.04 48.64,42.04 48.26,41.66 47.75,41.15 47.75,40.01 46.99,39.24 42.04,39.24 34.54,46.74 v31.11,46.74 25.4,46.74 25.15,46.99 v25.15,53.59 | 29.4,17.22 C15.2 v28.89,14.99 | 29.28,13.28 C3.- v28.95,8.13 C32.- | C19.2 22.23,5.08 v22.23,3.56 | v39.88,26.04 41.34,26.04 C28.2 | C24.2 55.56,24.77 C29.2 54.86,23.37 v54.99,23.24 | 54.19,17.33 54.19,18.51 v54.23,18.54 | v28.45,61.09 28.45,62.23 v29.46,63.25 v31.75,63.25 v33.91,63.25 | v25.15,53.59 v25.15,58.67 v25.15,61.09 | IC4.4 30.75,34.63 35.39,34.63 | 35.39,34.63 C33.2 | D3.A 28.19,24.89 v27.05,24.26 | R51.1 35.05,34.67 v35.81,35.05 | 35.39,34.63 v35.81,35.05 | v35.81,35.05 35.43,34.42 | v18.54,29.08 18.54,28 | v25.15,53.59 26.23,53.59 C16.2 | v16.64,51.69 20.57,51.69 v21.59,50.67
  Top 1.25: 55.12,63.88 v55.24,63.88 v71.63,63.88 v89.03,63.88 | v12.06,69.56 v12.06,64.39 12.06,41.2 C17.- 10.82,39.09 13.97,35.94 v20.83,35.94 v21.97,35.94 | v22.23,20.32 C18.-
  Top 1.27: v91.82,63.88 v89.03,63.88
  Top 2.54: D15.A 17.91,20.19
  Bottom 0.254: 85.98,38.73 v89.03,38.73 95.89,38.73 96.14,38.48 96.14,27.81 | 85.98,38.73 v80.9,38.73 | SV1.6 47.12,42.16 v47.75,41.53 | v71.75,45.34 69.47,42.93 v67.18,42.93 | 96.14,46.99 96.01,49.78 | v39.88,26.04 39.88,20.19 41.02,19.05 v42.29,19.05 | 55.37,26.42 v54.99,23.24 | 85.98,38.73 v85.98,39.62 | v28.95,8.13 24.26,8.13 v24.26,3.68 | v29.34,3.68 v28.07,3.68 | v30.61,3.68 31.24,3.68 | v29.46,24.26 27.43,22.1 27.43,19.05 v26.92,18.16 | v29.34,18.16 29.34,18.8 | 24.96,61.09 C9.2 | v34.29,60.45 36,60.45 C7.2 | v33.91,63.25 34.29,63.95 C10.2 | v31.75,63.25 C8.2 | v29.46,63.25 C14.2 | 31.62,72.26 C4.2 | 31.62,72.26 C5.2 | 31.62,72.26 31.62,71.25 v32.13,70.74 31.5,70.1 19.18,70.1 17.4,68.33 RJ45.11 10.29,68.33 8.89,69.72 7.24,69.72 RJ45.9 | v28.45,56.13 28.83,52.32 | 11.05,69.6 11.94,69.6 12.06,69.47 | v12.06,64.39 12.06,63.05 C34.2
  Bottom 0.5: v69.09,29.72 69.09,28.7 66.8,26.42 64.39,26.42 | 64.39,26.42 55.37,26.42 54.48,26.42 48.9,32 43.81,32 39.88,28.07 v39.88,26.04 38.86,26.04 | 64.39,26.42 64.45,26.36 | 38.86,26.04 38.86,38.99 v31.11,46.74 | v28.95,8.13 36.55,15.73 | 36.55,15.73 36.44,15.88 36.19,15.74 36.2,7.75 | v28.89,14.99 33.15,18.86 | 36.55,15.73 36.55,15.85 36.2,7.75 | 36.2,7.75 38.86,8 38.86,26.04 | v54.23,18.54 54.23,22.48 v54.99,23.24 | 24.96,61.09 v25.15,61.09 v28.45,61.09 | v33.91,63.25 33.91,60.83 v34.29,60.45 | v25.15,53.59 25.15,53.85 | v20.83,73.91 17.28,73.91 RJ45.8 | v4.57,73.91 6.73,73.91 11.05,69.6 12.03,69.6 v12.06,69.56 | v35.81,35.05 35.43,33.78 35.31,33.66 | v27.05,24.26 27.05,22.48 27.43,22.1 | C18.- 18.54,21.08 v18.54,29.08 | 21.34,50.16 21.34,48.77 | C2.1 16.45,54.42 16.51,54.36 16.51,51.82 v16.64,51.69 | v21.59,50.67 21.59,50.04
  Bottom 1.25: 47.62,1.91 60.07,1.91 60.07,15.88 72.01,27.81 96.14,27.81 96.14,46.99 | 47.62,1.91 22.23,1.91 v22.23,3.56 v22.23,20.32 | 47.62,1.91 47.62,5.04 X3.2 | KBD.8 56.01,71.37 55.24,70.61 v55.24,63.88 | RFID.7 RFID.8 72.52,70.87 71.63,69.98 v71.63,63.88 | BOLT.8 BOLT.7 | 9.14,20.19 9.53,20.95 | RJ45.7 RJ45.8 16.26,71.25 14.57,69.55 v12.06,69.56 | v21.97,35.94 22.61,35.94 26.92,31.62 26.92,23.88 v27.05,24.26
  Bottom 1.27: X3.2 47.62,5.08 | KBD.8 KBD.7 | 96.14,46.99 96.14,51.56 91.06,56.64 91.06,60.71 91.82,61.47 v91.82,63.88 | BOLT.8 89.03,70.61 88.27,69.85 88.27,65.91 89.03,65.15 v89.03,63.88
  Bottom 2.54: 6.86,20.19 D15.A 9.14,20.19 17.65,20.19 C18.- | 9.53,20.95 9.53,38.66 C17.-
  other vias: 25.53,3.68 26.8,3.68 28.07,37.47 28.07,36.2 29.21,37.47 29.21,36.2 30.35,37.47 30.35,36.2 31.5,37.47 31.5,36.2 32.64,37.47 32.64,36.2 32,35.05 32,33.78 33.27,35.05 34.54,35.05 26.92,21.46 23.11,35.94 24.26,35.94 25.4,35.94 25.4,34.8 24.26,34.8 23.11,34.8 21.97,34.8
  pour Bottom (isolate 0.5, no thermals): 39.88,2.03 39.75,1.91 22.86,1.91 22.73,2.03
  pour Bottom (isolate 0.254): 19.94,40.51 34.67,40.51 36.7,38.23 36.7,2.92 23.62,2.92 23.62,31.88 19.94,35.56
  pour Bottom (isolate 0.254): 39.62,33.91 39.62,12.57 39.75,12.45 51.18,12.45 51.82,11.81 51.82,9.78 52.07,9.53 58.29,9.53 58.42,9.65 58.42,17.02 70.61,29.21 70.61,34.29 70.36,34.54 40.26,34.54
  pour Bottom (isolate 0.254): 36.7,2.92 40.51,2.92 40.89,3.43 40.89,6.6 42.04,7.75 48.13,7.75 49.15,6.6 49.15,3.68 49.53,3.3 57.78,3.17 58.42,3.81 58.42,8.26 57.78,8.89 51.56,8.89 50.93,9.53 50.93,11.43 50.8,11.56 36.7,11.56
  pour Bottom (isolate 0.254): 24.26,79.76 24.13,79.76 22.86,78.36 22.86,71.88 20.83,71.88 20.83,61.09 17.53,57.91 5.84,57.91 5.84,41.15 22.35,41.15 25.78,44.58 32,44.58 42.93,44.7 42.93,79.12 42.42,79.63 24.26,79.63
  pour Top (isolate 0.254): 20.07,35.56 23.62,32 23.62,3.05 23.75,2.92 31.11,2.92 31.62,3.43 31.62,14.35 30.1,15.88 30.1,27.3 29.46,27.94 26.92,27.94 25.78,29.08 25.65,31.5 26.8,32.64 26.8,35.43 28.57,35.43 30.73,33.27 36.45,33.27 36.58,33.4 36.58,36.07 36.32,36.07 35.81,36.58 35.81,38.73 20.07,38.73 20.07,35.69 20.19,35.56
  pour Top: 12.45,41.4 12.45,38.35 13.08,37.72 20.07,37.72 20.07,38.73 23.11,38.73 23.11,32.51 21.46,34.16 6.99,34.16 6.99,41.02 7.37,41.4
  pour Top: 6.99,30.48 20.57,30.48 20.57,27.81 6.99,27.94 6.22,28.7 6.22,29.72
  pour Bottom: 11.68,40.39 11.68,23.11 17.91,23.11 17.91,17.78 2.67,17.78 2.79,40.39
MISO  (via drill 0.6)
  Top 0.254: IC2.16 61.22,36.58 61.21,36.58 | IC2.16 61.34,36.48 | v62.36,34.92 62.36,35.46 IC2.16 | R7.1 41.46,47.43 SV1.1
  Bottom 0.254: v62.36,34.92 61.21,33.78 59.94,33.78 58.17,35.56 55.88,35.56 48.01,43.43 40.64,43.43 39.88,44.2 39.88,45.85 SV1.1
MOSI  (via drill 0.6)
  Top 0.254: v60.45,34.92 60.45,36.57 IC2.15 | SV1.4 43.56,44.45 43.05,44.45 42.04,43.43 39.12,43.43 31.68,50.87 IC1.7
  Bottom 0.254: v60.45,34.92 60.45,35.94 59.94,36.45 56.01,36.45 47.75,44.7 SV1.4
N$1
  Top 0.254: RJ45.1 9.14,74.42 8.89,74.17 8.89,71.88 10.29,70.48 10.29,65.91 9.53,65.15 9.46,65.09 7.49,63.12 U$1.9
N$2
  Top 0.254: U$1.10 6.99,60.58 10.1,63.69 10.16,63.75 10.92,64.52 10.92,71.88 10.16,72.64 RJ45.2
N$3
  Top 0.254: U$1.8 16.76,63.12 15.75,64.14 15.75,70.23 17.65,72.14 17.65,74.3 15.75,76.2 12.57,76.2 11.2,74.83 RJ45.3
N$4
  Top 0.254: U$1.7 18.29,60.71 | 18.29,60.71 17.78,60.83 15.11,63.5 15.11,71.75 14.22,72.64 RJ45.6 | 18.29,60.71 18.16,60.83
N$5
  Bottom 0.254: 19.62,68.26 RJ45.12 19.68,68.2 R2.2
N$6
  Bottom 0.254: R1.2 RJ45.10
N$7  (via drill 0.6)
  Top 0.254: v17.14,65.91 17.65,66.42 21.84,66.42 24.77,63.5 27.05,63.5 28.43,64.88 IC1.27
  Bottom 0.254: R1.1 8.96,63.82 9.53,64.39 9.53,66.04 10.29,66.8 16.26,66.8 v17.14,65.91
N$8  (via drill 0.6)
  Top 0.254: IC1.26 29.08,64.77 27.3,62.99 24.51,62.99 22.86,64.64 v21.59,64.64
  Bottom 0.254: R2.1 19.75,63.25 20.7,63.25 21.59,64.14 v21.59,64.64
N$9  (via drill 0.6)
  Top 0.5: U$1.14 v8.38,50.42
  Bottom 0.254: 10.09,50.42 R4.2 10.22,50.29 | R3.2 10.22,46.42 10.67,46.35
  Bottom 0.5: v8.38,50.42 10.09,50.42 | 10.67,46.35 11.68,47.37 11.68,50.04 11.43,50.29 10.22,50.29 | R4.2 C1.2 10.1,52.58 9.27,52.58 8.38,53.47 8.38,54.99 9.14,55.75 18.16,55.75 20.45,58.04 L1.2
N$12
  Top 0.254: IC1.10 33.63,55.91 33.91,55.63 36.7,55.63 37.21,56.13 R8.2
N$13
  Bottom 0.254: 14.93,50.42 R6.2 14.8,50.29 | R5.2 14.67,46.29
  Bottom 0.5: 14.67,46.29 13.59,47.37 13.59,50.04 13.84,50.29 14.8,50.29 | R6.2 C2.2
N$16
  Top 0.254: IC1.14 36.42,58.8 R11.2 R10.2
N$17
  Top 0.254: 27.81,58.57 IC1.1 27.78,58.26 27.56,58.04
  Top 0.5: C16.1 26.54,57.02 27.56,58.04
N$18  (via drill 0.6)
  Top 0.254: IC1.24 30.35,65.88 30.35,68.83 26.92,72.26 v26.8,72.26 Q1.1
  Bottom 0.254: v26.8,72.26 C4.1
N$19  (via drill 0.6)
  Top 0.254: IC1.6 31.11,58.52 31.11,50.04 33.15,48.01 v33.15,47.88 | v39.5,49.02 39.56,49.09 R7.2
  Bottom 0.254: v33.15,47.88 34.16,49.02 v39.5,49.02
N$20  (via drill 0.6)
  Top 0.254: IC1.23 30.99,65.9 30.99,71.12 32.13,72.26 v36.45,72.26 Q1.2
  Bottom 0.254: v36.45,72.26 C5.1
N$21
  Bottom 2.54: X2.3 76.58,5.14 76.58,8.64 79.88,11.94 79.88,13.46 K2.4
N$23
  Top 0.254: K1.1 88.65,33.66 D1.A 89.49,35.13 89.92,35.56 94.36,35.56 95.12,36.32 95.12,41.66 94.78,41.99 T1.C
N$24
  Top 2.54: X1.2 86.87,5.19 86.87,7.62 89.28,10.03 89.28,16.51 K1.2
N$25
  Top 0.254: R12.2 87.76,37.72 87.76,39.12 88.52,39.88 92.18,39.88 T1.B
N$26
  Bottom 2.54: K1.3 85.47,10.54 81.79,6.86 81.79,5.11 X1.1
N$27
  Top 0.254: LED1.A 88.45,36.83 R13.2
N$28
  Top 0.254: K2.1 77.22,33.66 D2.A 78.06,35.13 78.49,35.56 83.06,35.56 83.06,40.26 76.96,40.26 75.69,41.53 74.08,41.53 T2.C
N$29
  Top 0.254: R14.2 72.77,38.97 T2.B
N$30
  Bottom 2.54: K1.4 91.82,15.24 91.82,5.25 arc-45 X1.3
N$31
  Top 2.54: K2.2 74.04,19.68 68.96,14.61 68.96,10.79 71.5,8.26 X2.2
N$32
  Bottom 2.54: K2.3 72.52,12.7 66.55,6.73 66.55,5.11 X2.1
N$33
  Top 0.254: R15.2 75.75,36.38 76.2,36.83 LED2.A
N$34  (via drill 0.6)
  Top 0.254: KBD.3 50.93,74.93 49.78,76.07 48.39,76.07 47.24,74.93 47.24,72.9 v50.29,69.85 | R18.1 54.1,61.85 52.32,63.63 v50.93,63.63
  Bottom 0.254: RFID.3 67.44,74.93 66.29,76.07 65.02,76.07 63.88,74.93 63.88,72.01 62.36,70.48 59.69,70.48 57.91,72.26 57.91,74.42 55.5,76.83 51.94,76.83 50.93,75.82 KBD.3 | v50.93,63.63 50.29,63.63 v50.29,69.85
N$35  (via drill 0.6)
  Top 0.254: R17.1 v49.02,62.61
  Bottom 0.254: KBD.2 49.91,71.75 49.15,70.99 49.15,62.74 v49.02,62.61
N$37
  Top 0.254: IC5.2 12.7,26.67 13.34,26.04 13.34,25.02 13.59,24.77 19.56,24.77 19.94,25.15 R35.2 22.04,26.1 R34.1
N$38
  Top 0.254: IC5.5 12.32,30.73 12.57,30.73 13.97,32.13 14.29,32.13 C21.1 R37.2
N$39
  Top 0.254: R36.1 C22.1
N$40
  Top 0.254: IC5.6 12.7,31.75 13.46,32.51 13.46,33.02 13.84,33.4 19.56,33.4 19.94,33.02 C20.1
N$41  (via drill 0.6)
  Top 0.254: R27.2 R19.1 59.18,62.1 v59.44,62.48
  Bottom 0.254: KBD.6 53.98,61.72 54.74,60.96 59.05,60.96 59.44,61.34 v59.44,62.48
N$42  (via drill 0.6)
  Top 0.254: v46.99,66.29 47.37,65.91 47.37,59.56 46.93,59.12 R28.2 R16.1
  Bottom 0.254: KBD.1 46.74,72.77 46.74,66.42 v46.99,66.29
N$43  (via drill 1.7)
  other vias: 44.32,73.79
N$45  (via drill 0.6)
  Top 0.254: U$1.6 17.65,58.04 v16.38,59.31
  Bottom 0.254: v16.38,59.31 16.38,60.52 R52.2
N$46
  Top 0.5: R33.2 26.86,37.97 26.89,38 | 26.89,38 IC4.8 IC4.7 | IC4.1 26.92,38.61 26.89,38
N$47  (via drill 0.6)
  Top 0.254: U$1.11 7.24,58.04 v8.51,59.31
  Bottom 0.254: v8.51,59.31 8.51,60.39 R53.2
N$48  (via drill 0.6)
  Top 0.254: BOLT.3 83.95,75.18 82.8,76.33 81.66,76.33 v80.14,74.8 | R25.1 v74.42,62.48
  Bottom 0.254: v80.14,74.8 80.14,73.91 78.87,72.64 78.87,70.99 77.09,69.22 77.09,67.69 74.42,65.02 v74.42,62.48
N$49  (via drill 0.6)
  Top 0.254: R32.2 76.96,61.98 v77.47,62.48 78.23,62.48 79.5,61.21 R23.1
  Bottom 0.254: BOLT.1 79.76,72.77 79.76,64.01 78.23,62.48 v77.47,62.48
N$50  (via drill 1.7)
  other vias: 60.71,73.79
N$51  (via drill 0.6)
  Top 0.254: R28.1 46.23,61.98 v45.59,62.61
  Bottom 0.254: v45.59,62.61 KBD.9
N$52  (via drill 0.6)
  Top 0.254: R27.1 55.81,59.12 55.37,59.56 55.37,61.85 55.88,62.36 v57.91,62.36
  Bottom 0.254: 57.53,67.82 KBD.11 57.91,67.44 v57.91,62.36
N$53  (via drill 1.7)
  other vias: 77.22,73.79
N$54  (via drill 1.7)
  other vias: 93.6,73.79
N$55  (via drill 0.6)
  Top 0.254: R24.1 v82.04,62.48
  Bottom 0.254: BOLT.2 82.93,70.99 83.82,70.1 83.82,64.9 82.04,63.12 v82.04,62.48
N$56  (via drill 0.6)
  Top 0.254: R22.1 69.34,61.28 v70.55,62.48 71.88,61.15 R29.2
  Bottom 0.254: 70.48,62.29 v70.55,62.48 70.55,72.83 RFID.6
N$57  (via drill 0.6)
  Top 0.254: R30.1 60.77,59.12 60.45,59.44 60.45,61.98 60.83,62.36 v62.99,62.36
  Bottom 0.254: 61.98,68.2 RFID.9 62.99,67.44 v62.99,62.36
N$58  (via drill 0.6)
  Top 0.254: R29.1 72.84,59.12 73.03,59.31 v73.03,62.48
  Bottom 0.254: RFID.11 73.53,65.72 73.03,65.21 v73.03,62.48
N$59  (via drill 0.6)
  Top 0.254: R26.1 R31.2 v87.12,62.48
  Bottom 0.254: BOLT.6 87,72.39 87.12,72.26 v87.12,62.48
N$60  (via drill 0.6)
  Top 0.254: v75.95,62.48 75.69,62.23 75.69,59.31 75.82,59.18 76.9,59.18 R32.1
  Bottom 0.254: BOLT.9 77.09,66.8 77.09,63.63 v75.95,62.48
N$61  (via drill 0.6)
  Top 0.254: v88.9,62.23 88.9,59.82 88.27,59.18 87.18,59.18 R31.1
  Bottom 0.254: BOLT.11 90.04,63.37 v88.9,62.23
N$62
  Top 0.254: R41.2 C24.1 59.05,24.7
N$63
  Top 0.254: C25.1 R50.2 | C25.1 55.69,15.49 56.39,15.49 57.02,16.13 57.02,21.89 D16.C | C26.1 C25.1
N$64
  Top 0.254: R42.1 C26.2
N$65  (via drill 0.6)
  Top 0.254: R43.2 48.26,15.43 | 48.26,15.43 C27.2 49.91,13.84 50.61,13.14 R42.2 | IC6.3 46.04,27.3 v48.51,27.3 | 48.26,15.43 v48.26,14.22
  Bottom 0.254: v48.26,14.22 v48.51,27.3
N$67  (via drill 0.6)
  Top 0.254: 42.55,15.43 R45.1 | 42.55,15.43 R44.1 | IC6.2 47.88,28.7 v48.26,29.08 | v42.55,13.97 42.55,15.37 42.55,15.43 | v46.86,24.13 C30.2
  Bottom 0.254: v48.26,29.08 45.47,26.29 45.47,24.13 | 45.47,24.13 45.47,18.16 42.42,15.11 v42.55,13.97 | 45.47,24.13 v46.86,24.13
N$68
  Top 0.5: IC4.3 29.46,32.89 29.84,32.51 33.62,32.51 C33.1
N$69
  Top 0.254: R46.2 C31.1 52.83,22.48 53.47,23.11 53.47,26.8 52.83,27.43 IC6.6
N$70  (via drill 0.6)
  Top 0.254: R48.1 40.19,22.54 39.75,22.1 39.75,19.81 40.64,18.92 40.64,17.84 R45.2 | IC6.1 45.79,29.84 v43.56,29.84 | R48.1 41.15,22.61 | v42.42,24.13 41.66,24.13 41.15,23.62 R48.1 | R46.1 C30.1 46.86,19.94 45.97,19.05 v43.94,19.05
  Bottom 0.254: v43.56,29.84 42.42,28.7 v42.42,24.13 42.42,22.48 43.94,20.95 v43.94,19.05
N$72
  Bottom 0.254: R53.1 12.25,60.83 C34.1 14.86,60.9 R52.1
N$76
  Top 0.5: IC4.5 35.05,39.43 | 35.05,39.43 R51.2 | 35.05,39.43 36.96,39.43 R47.1
N$81
  Top 0.254: R49.1 44.13,20.57 | R48.2 R49.1 | R49.1 45.41,20.64 45.47,20.7 45.47,24.64 45.97,25.15 50.16,25.15 51.05,26.04 50.99,26.04 IC6.5
PB0  (via drill 0.6)
  Top 0.254: v67.44,45.97 67.94,45.97 69.47,44.45 69.47,38.61 v68.2,37.34 | v56.9,34.04 58.04,35.18 58.04,36.58 IC2.12 | R49.2 v43.94,24.13 | v48.26,30.86 49.28,29.84 49.28,29.08 49.66,28.7 IC6.7 52.45,28.7 53.47,29.72 53.47,33.02 v54.48,34.04 | v62.87,57.02 63.25,57.02 64.26,58.04 R20.2
  Bottom 0.254: 67.82,45.97 v67.44,45.97 60.2,45.97 57.53,48.64 57.53,55.37 61.21,55.37 v62.87,57.02 | v68.2,37.34 67.56,37.34 63.25,33.02 57.91,33.02 v56.9,34.04 v54.48,34.04 | v43.94,24.13 43.94,26.92 47.88,30.86 v48.26,30.86
PB1  (via drill 0.6)
  Top 0.254: IC2.13 58.82,37.74 v59.69,38.61 | R13.1 R12.1 84.78,42.29 84.71,42.35 | v74.3,43.81 75.75,42.35 84.71,42.35 | 84.71,42.35 85.66,42.35 SV3.7
  Bottom 0.254: v59.69,38.61 68.33,38.61 73.53,43.81 v74.3,43.81
PB2  (via drill 0.6)
  Top 0.254: IC2.14 59.56,36.54 59.56,35.18 v58.42,34.04 | IC1.9 32.98,55.09 34.22,53.85 37.97,53.85 | 37.97,53.85 R9.2 | v38.1,46.86 37.97,46.99 37.97,53.85
  Bottom 0.254: v58.42,34.04 57.53,34.92 55.5,34.92 53.34,37.08 48.39,37.08 45.34,40.13 40.26,40.13 38.35,42.04 38.35,46.35 37.97,46.74 v38.1,46.86
PB7  (via drill 0.6)
  Top 0.254: v53.34,34.92 53.34,36.7 54.1,37.47 54.1,38.07 IC2.8 | R25.2 74.42,56.26 74.93,55.75 77.09,55.75 78.36,57.02 80.39,57.02 84.07,53.34 v87,53.34
  Bottom 0.254: v53.34,34.92 53.34,31.75 68.33,31.75 78.23,41.66 90.04,41.66 91.57,43.18 91.57,47.62 90.04,49.15 90.04,50.29 v87,53.34
PC0  (via drill 0.6)
  Top 0.254: IC2.23 60.93,42.89 v59.94,41.91 | v49.02,56.52 R17.2
  Bottom 0.254: v59.94,41.91 59.31,41.27 54.61,41.27 45.47,50.42 45.47,52.96 v49.02,56.52
PC1  (via drill 0.6)
  Top 0.254: IC2.24 59.82,43.69 v59.44,43.31 | R16.2 46.23,52.83 v47.12,51.94
  Bottom 0.254: v59.44,43.31 58.04,41.91 55.63,41.91 47.12,50.42 v47.12,51.94
PC2  (via drill 0.6)
  Top 0.254: IC2.25 63.22,45.19 v65.15,47.12 | R22.2 69.34,56.64 v69.72,56.26
  Bottom 0.254: v65.15,47.12 66.42,48.39 70.23,48.39 72.52,50.67 72.52,53.47 v69.72,56.26
PC3  (via drill 0.6)
  Top 0.254: IC2.26 60.42,47.09 62.36,49.02 v62.61,49.02 | R23.2 78.55,59.12 78.23,58.8 78.23,57.91 77.09,56.77 v75.82,56.77
  Bottom 0.254: v62.61,49.02 69.47,49.02 71.63,51.18 71.63,52.83 68.45,56.01 68.45,58.04 74.55,58.04 v75.82,56.77
PD2  (via drill 0.6)
  Top 0.254: v55.12,47.62 55.12,45.69 IC2.32 | R19.2 59.18,58.29 v57.4,56.52
  Bottom 0.254: v55.12,47.62 55.12,48.01 54.99,48.13 54.99,54.86 56.64,56.52 v57.4,56.52
PD3
  Top 0.254: IC2.1 52.45,45.37 52.45,55.63 54.1,57.28 R18.2
PD4  (via drill 0.6)
  Top 0.254: IC2.2 56.99,42.89 v57.02,42.93 | 71.63,44.32 70.87,44.32 70.48,44.7 70.48,46.23 v69.47,47.24 | 71.63,44.32 72.9,44.32 73.28,44.7 74.93,44.7 76.58,43.05 83.82,43.05 SV3.5 | R15.1 R14.1 72.32,34.48 71.63,35.18 71.63,44.32
  Bottom 0.254: v57.02,42.93 57.02,43.05 58.8,44.83 67.69,44.83 69.72,46.86 69.72,46.99 v69.47,47.24
PD5  (via drill 0.6)
  Top 0.254: IC2.9 55.62,32.77 v55.63,33.15 56.01,33.15 58.55,30.61 58.55,29.19 T4.B | SV3.4 82.55,46.99 79.63,49.91 79.63,54.86 67.94,54.86 66.8,56.01 R21.2 | T4.B | T4.B 58.73,29.14 59.31,29.46 65.38,29.46 T3.B
  Bottom 0.254: v55.63,33.15 55.63,32.38 63.5,32.38 66.8,35.69 67.94,35.69 78.61,46.35 78.61,47.5 79.5,48.39 81.28,48.39 SV3.4
PD6  (via drill 0.6)
  Top 0.254: v56.39,38.73 56.42,38.58 IC2.10 | v82.04,57.66 R24.2
  Bottom 0.254: v56.39,38.73 56.39,39.62 57.15,40.39 68.33,40.39 82.04,54.48 v82.04,57.66
PD7  (via drill 0.6)
  Top 0.254: v58.04,39.12 57.66,39.12 57.66,38.35 57.22,37.92 IC2.11 | R26.2 84.58,56.13 v84.84,55.88
  Bottom 0.254: v58.04,39.12 58.04,39.62 68.58,39.62 76.33,47.5 78.74,49.91 84.84,49.91 | 84.84,49.91 88.65,49.91 89.03,49.53 89.03,45.59 90.17,44.45 SV3.9 | 84.84,49.91 v84.84,55.88
RXD
  Top 0.254: IC2.30 57.28,45.24 57.28,48.51 56.26,49.53 SV2.5 SV2.6
SCK  (via drill 0.6)
  Top 0.254: IC2.17 62.71,37.24 v64.14,35.81 | SV1.3 38.99,44.7 32.33,51.36 IC1.8
  Bottom 0.254: SV1.3 42.55,45.97 47.5,45.97 56.01,37.47 62.48,37.47 v64.14,35.81 64.01,35.81
SCL  (via drill 0.6)
  Top 0.254: SV2.7 58.8,45.21 IC2.28 | IC3.6 v70.23,51.69 70.17,51.62 R39.1
  Bottom 0.254: SV2.7 60.07,52.07 69.85,52.07 v70.23,51.69
SDA
  Top 0.254: IC2.27 59.56,45.24 59.56,49.02 SV2.9 61.98,50.8 61.98,50.93 63.12,52.07 65.79,52.07 66.23,51.62 R40.1 66.42,52.58 66.8,52.96 IC3.5
SWE
  Top 0.5: IC4.2 28.19,30.96 27.56,30.32
  Top 1.25: D3.C 27.56,30.32 34.41,30.32 L2.2
  pour Top (isolate 0.254): 36.96,31.88 36.96,28.57 27.56,28.57 26.29,29.72 26.29,31.11 28.19,33.02 28.45,33.02 29.59,31.88
TPIN+  (via drill 0.6)
  Top 0.254: v17.53,44.07 U$1.1 | IC1.13 35.58,57.51 v36.2,56.9
  Bottom 0.254: R5.1 14.93,44.07 | v36.2,56.9 35.43,56.13 34.42,56.13 33.4,57.15 26.04,57.15 18.41,49.53 18.41,44.96 v17.53,44.07
  Bottom 0.5: 14.93,44.07 v17.53,44.07
TPIN-  (via drill 0.6)
  Top 0.254: v34.8,57.02 34.92,57.15 IC1.12
  Top 0.5: v16.64,47.88 U$1.2
  Bottom 0.254: v34.8,57.02 34.04,57.78 25.65,57.78 17.27,49.53 17.27,48 17.24,47.97 16.68,47.84 v16.64,47.88
  Bottom 0.5: R6.1 15.94,48.45 v16.64,47.88
TPOUT+  (via drill 0.6)
  Top 0.254: U$1.16 v7.37,44.07 | v29.97,60.96 31.11,62.1 34.16,62.1 34.92,62.87 IC1.17
  Bottom 0.254: 10.1,44.07 R3.1 | v29.97,60.96 29.08,60.07 20.7,60.07 17.78,57.15 8.76,57.15 6.73,55.12 6.73,47.62 7.37,46.99 v7.37,44.07
  Bottom 0.5: v7.37,44.07 10.1,44.07
TPOUT-  (via drill 0.6)
  Top 0.254: IC1.16 35.56,65.84 35.56,62.61 34.42,61.47 32,61.47 31.5,60.96 v31.37,60.96
  Top 0.5: U$1.15 v8.38,47.88
  Bottom 0.254: v31.37,60.96 29.97,59.56 20.95,59.56 17.91,56.52 9.02,56.52 7.37,54.86 7.37,48.9 v8.38,47.88
  Bottom 0.5: v8.38,47.88 9.59,47.88 R4.1
TXD
  Top 0.254: IC2.31 56.39,45.22 56.39,48.26 53.85,50.8 SV2.3 SV2.4

### Text on the board
Top: http://dc.osaa.dk
Bottom: http://dc.osaa.dk
tPlace: http://dren.dk | LAN | Bolt | Keyboard | RFID | RST | TXD | RXD | !RFID | GND | FTDI | http://dren.dk | ICSP | ADC7 | PD5 | COIL | +12v | GND | TXD | RXD | SCL | SDA | +3v3 | +3v3 | http://dren.dk | GND | GND | 35V | GPIO | PD4 | PB1 | PD7 | ADC6 | K2 | K1 | On-board RFID reader | PNP | 2x | 16V | 1 | 2 | 3 | Ver 2.1 | 1 | 2 | 3 | 1 | 2 | 3 | +12V 2A | GND
bPlace: http://dc.osaa.dk | Ver 2.1